# EAGLE design 808_CB (EAGLE 7.1.0)
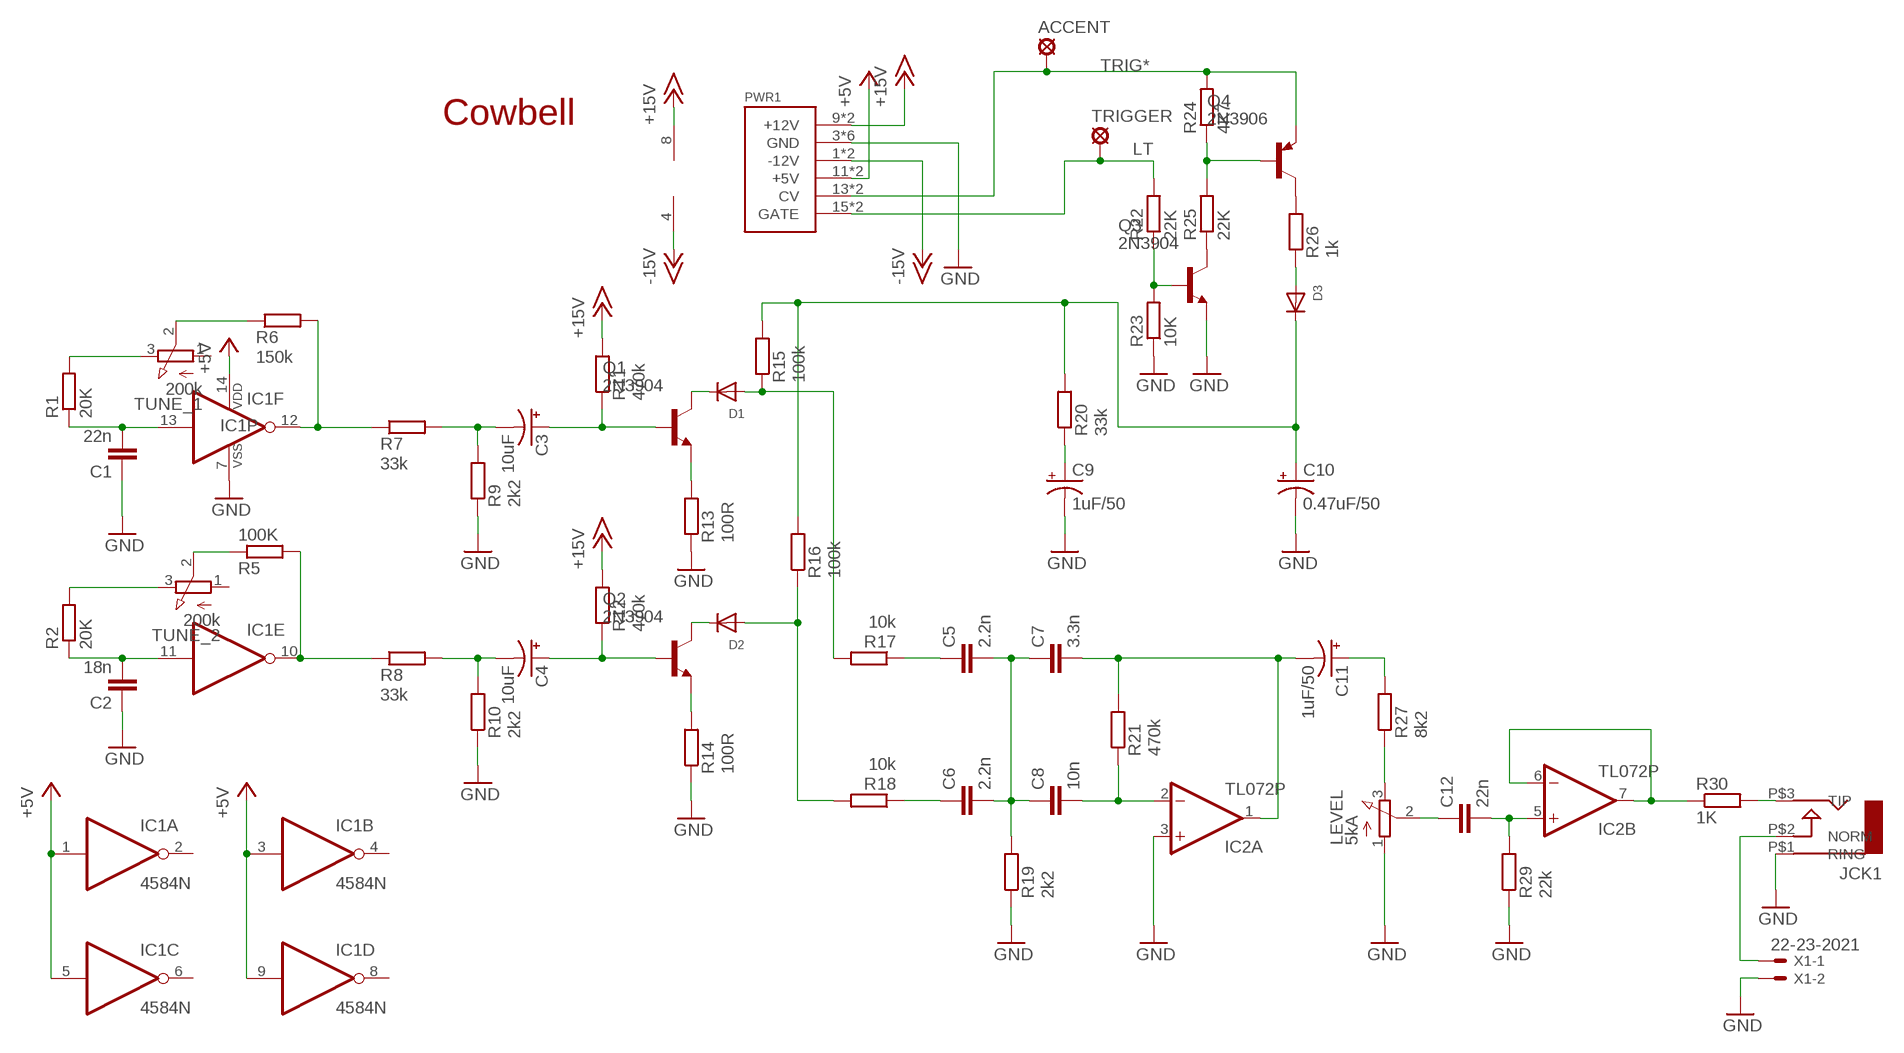
[diagram p0: schematic, sheet 1]

## Parts
ACCENT  LSP11  [LSP11]
C1  22n  C-EU4MM_PITCH  [C035-030X60]
C2  18n  C-EU4MM_PITCH  [C035-030X60]
C3  10uF  CPOL-USB45181A  [B45181A]
C4  10uF  CPOL-USB45181A  [B45181A]
C5  2.2n  C-EU3.5MM_PITCH  [C035-025X75]
C6  2.2n  C-EU3.5MM_PITCH  [C035-025X75]
C7  3.3n  C-EU3.5MM_PITCH  [C035-025X75]
C8  10n  C-EU3.5MM_PITCH  [C035-025X75]
C9  1uF/50  CPOL-USB45181A  [B45181A]
C10  0.47uF/50  CPOL-USB45181A  [B45181A]
C11  1uF/50  CPOL-USB45181A  [B45181A]
C12  22n  C-EU3.5MM_PITCH  [C035-025X75]
D1  DIODEDO-1N4148  [DO-1N4148]
D2  DIODEDO-1N4148  [DO-1N4148]
D3  DIODEDO-1N4148  [DO-1N4148]
IC1  4584N  [DIL14]
IC2  TL072P  [DIL08]
JCK1  AUDIO-JACK  [ERTHENVAR-JACK-90DEG]
LEVEL  5kA  3RP/1610N  [3RP/1610N]
PWR1  POWER  [POWER_16]
Q1  2N3904  [TO92]
Q2  2N3904  [TO92]
Q3  2N3904  [TO92]
Q4  2N3906  [TO92]
R1  20K  R-EU_0207/5V  [0207/5V]
R2  20K  R-EU_0207/5V  [0207/5V]
R5  100K  R-EU_0207/5V  [0207/5V]
R6  150k  R-EU_0207/5V  [0207/5V]
R7  33k  R-EU_0207/5V  [0207/5V]
R8  33k  R-EU_0207/7  [0207/7]
R9  2k2  R-EU_0207/5V  [0207/5V]
R10  2k2  R-EU_0207/5V  [0207/5V]
R11  470k  R-EU_0207/5V  [0207/5V]
R12  470k  R-EU_0207/5V  [0207/5V]
R13  100R  R-EU_0207/5V  [0207/5V]
R14  100R  R-EU_0207/5V  [0207/5V]
R15  100k  R-EU_0207/5V  [0207/5V]
R16  100k  R-EU_0207/5V  [0207/5V]
R17  10k  R-EU_0207/5V  [0207/5V]
R18  10k  R-EU_0207/5V  [0207/5V]
R19  2k2  R-EU_0207/5V  [0207/5V]
R20  33k  R-EU_0207/5V  [0207/5V]
R21  470k  R-EU_0207/5V  [0207/5V]
R22  22K  R-EU_0207/5V  [0207/5V]
R23  10K  R-EU_0207/5V  [0207/5V]
R24  4K7  R-EU_0207/5V  [0207/5V]
R25  22K  R-EU_0207/5V  [0207/5V]
R26  1k  R-EU_0207/5V  [0207/5V]
R27  8k2  R-EU_0207/5V  [0207/5V]
R29  22k  R-EU_0207/5V  [0207/5V]
R30  1K  R-EU_0207/5V  [0207/5V]
TRIGGER  LSP11  [LSP11]
TUNE_1  200k  3RP/1610N  [3RP/1610N]
TUNE_2  200k  3RP/1610N  [3RP/1610N]
X1  22-23-2021  [22-23-2021]

## Nets
+5V: IC1.1(A:I) IC1.3(B:I) IC1.5(C:I) IC1.9(D:I) IC1.14(P:VDD) PWR1.11(+5V) PWR1.12(+5V)
+15V: IC2.8(P:V+) PWR1.9(+12V) PWR1.10(+12V) R11.2 R12.2
-15V: IC2.4(P:V-) PWR1.1(-12V) PWR1.2(-12V)
CY_OUT: JCK1.P$3(TIP) R30.2
GND [GND]: C1.P$1 C2.P$1 C9.- C10.- IC1.7(P:VSS) IC2.3(A:+IN) JCK1.P$1(RING) LEVEL.1(A) PWR1.3(GND) PWR1.4(GND) PWR1.5(GND) PWR1.6(GND) PWR1.7(GND) PWR1.8(GND) Q3.3(E) R9.1 R10.1 R13.1 R14.1 R19.1 R23.1 R29.1 X1.2
LT: PWR1.15(GATE) PWR1.16(GATE) R22.2 TRIGGER.MP
N$1: C2.P$2 IC1.11(E:I) R2.1
N$2: C1.P$2 IC1.13(F:I) R1.1
N$3: Q3.1(C) R25.1
N$4: R5.1 TUNE_2.2(S)
N$5: R6.1 TUNE_1.2(S)
N$6: IC1.12(F:O) R6.2 R7.1
N$7: R1.2 TUNE_1.3(E)
N$8: R2.2 TUNE_2.3(E)
N$9: C4.- R8.2 R10.2
N$10: C3.- R7.2 R9.2
N$11: C4.+ Q2.2(B) R12.1
N$12: C3.+ Q1.2(B) R11.1
N$13: Q1.3(E) R13.2
N$14: Q2.3(E) R14.2
N$15: D2.C Q2.1(C)
N$16: D1.C Q1.1(C)
N$17: C10.+ D3.C R15.2 R16.2 R20.2
N$18: Q4.1(C) R26.2
N$19: D3.A R26.1
N$20: C9.+ R20.1
N$21: D2.A R16.1 R18.2
N$22: D1.A R15.1 R17.2
N$23: C5.P$1 R17.1
N$24: C6.P$1 R18.1
N$25: C5.P$2 C6.P$2 C7.P$1 C8.P$1 R19.2
N$26: C8.P$2 IC2.2(A:-IN) R21.1
N$27: C7.P$2 C11.- IC2.1(A:OUT) R21.2
N$28: JCK1.P$2(NORM) X1.1
N$29: LEVEL.3(E) R27.1
N$30: C11.+ R27.2
N$31: C12.P$1 LEVEL.2(S)
N$32: C12.P$2 IC2.5(B:+IN) R29.2
N$33: IC2.6(B:-IN) IC2.7(B:OUT) R30.1
N$516: Q4.2(B) R24.1 R25.2
N$517: Q3.2(B) R22.1 R23.2
TP7: IC1.10(E:O) R5.2 R8.1
TRIG*: ACCENT.MP PWR1.13(CV) PWR1.14(CV) Q4.3(E) R24.2
Unconnected: IC1.2(A:O) IC1.4(B:O) IC1.6(C:O) IC1.8(D:O) TUNE_1.1(A) TUNE_2.1(A)

## Notes on the sheet
- Cowbell

## Library data of the parts
ACCENT TRIGGER = solpad:LSP11: SOLDER PAD drill 1.1 mm
C1 C2 C5-C8 C12 = TR808clone:C-EU: CAPACITOR, European symbol Pitch 3mm
C3 C4 C9-C11 = rcl:CPOL-US: POLARIZED CAPACITOR, American symbol
D1-D3 = 808_lt:DIODE: Diode SMADIODE - SMA Surface Mount Package 20V 1A Schottky Diode Digikey: 641-1014-6-ND DO-1N4148 - Through Hole Small Current Diode SOD-123 20V 1 A (.5mV Vf) Schottky Diode - Digikey: MBRX120TPMSCT-ND SOD-323 10V 570mA (.38mV Vf, 3ns) Schottky Diode - Digikey: ZLLS410CT-ND SOD-523 30V 30mA Schottky Diode (RB751S-40TE61) - Digikey: RB751S-40TE61CT-ND SOT23-R/W - SOT23 Package (R = Solder Paste/Reflow Ovens, W = Hand-Soldering) BAT54Film 40V 300mA - Digikey: 497-7162-1-ND
IC1 = TR808clone:4584: Hex SCHMITT TRIGGER (74C14)
IC2 = linear:TL072: OP AMP
JCK1 = erthenvar:AUDIO-JACK: Switching Mono 3.5mm Audio Jack from Erthenvar.
LEVEL TUNE_1 TUNE_2 = pot:3RP/1610N: 16mm Potentiometer one level Source: http://www.alphapotentiometers.net/html/16mm_pot_2.html
PWR1 = eurorack:POWER
Q1-Q3 = transistor-npn:2N3904: NPN Transistor
Q4 = transistor-pnp:2N3906: PNP Transistor
R1 R2 R5-R27 R29 R30 = TR808clone:R-EU_: RESISTOR, European symbol
X1 = con-molex:22-23-2021: .100" (2.54mm) Center Header - 2 Pin; MF: MOLEX; MPN: 22-23-2021; OC_FARNELL: 1462926; OC_NEWARK: 25C3832

## Net classes
0 default: width 0.635 mm, drill 0.254 mm, clearance 0.254 mm
1 GND: width 1.016 mm, drill 1.016 mm, clearance 0.508 mm

## Board
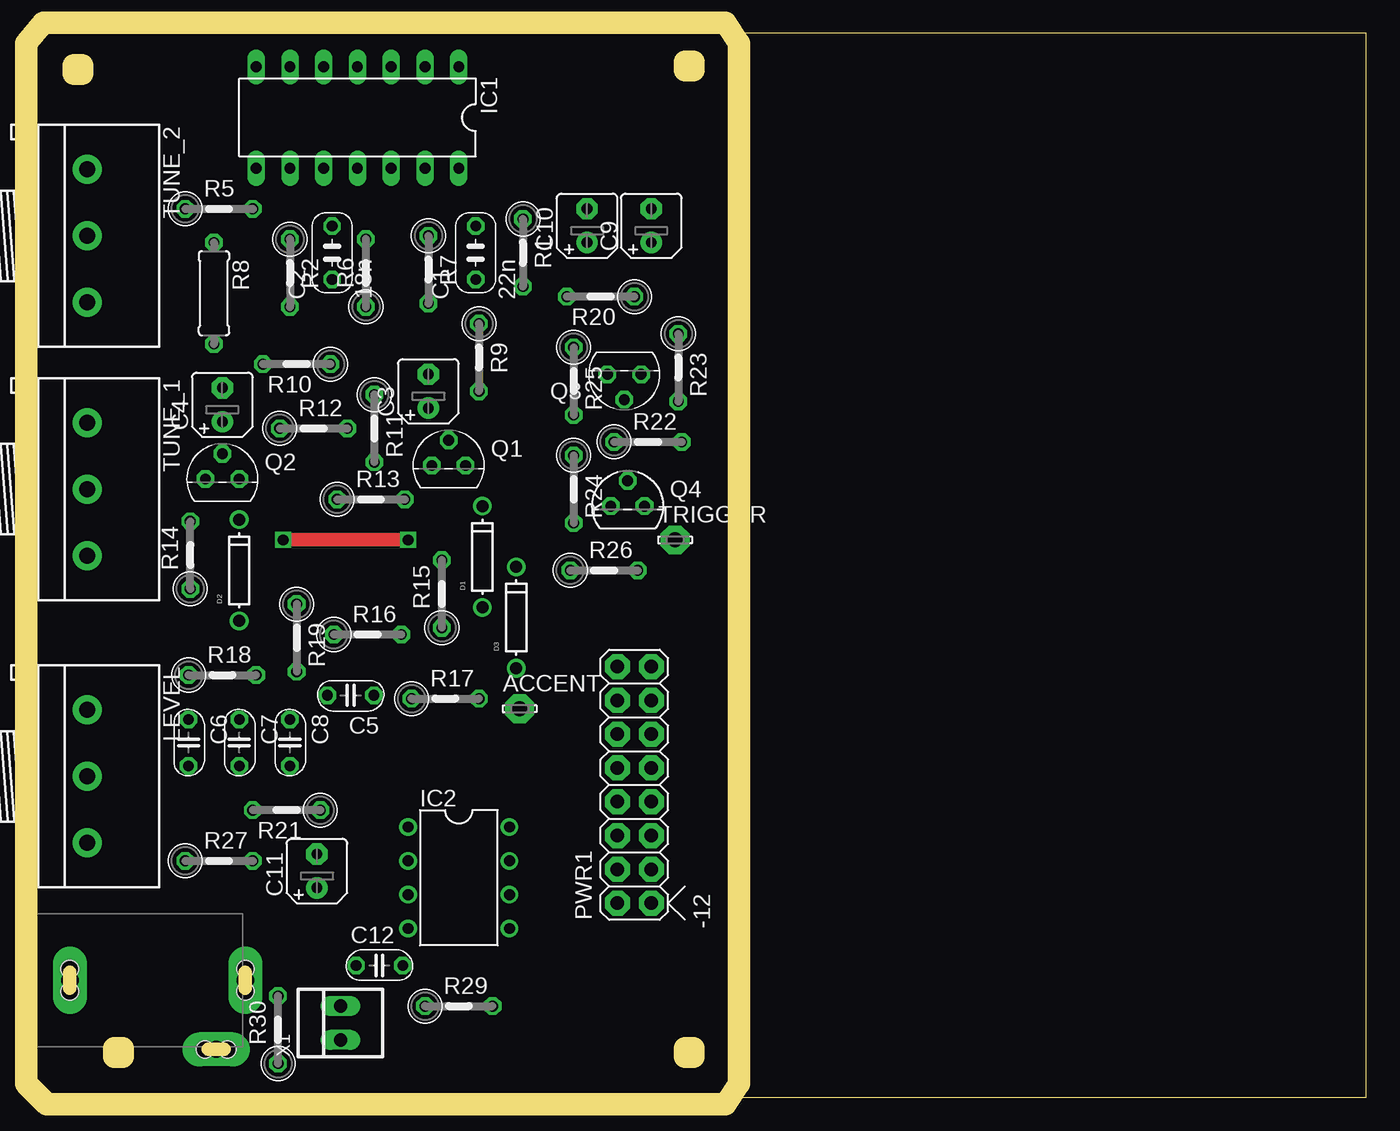
[diagram p1: board, top side]
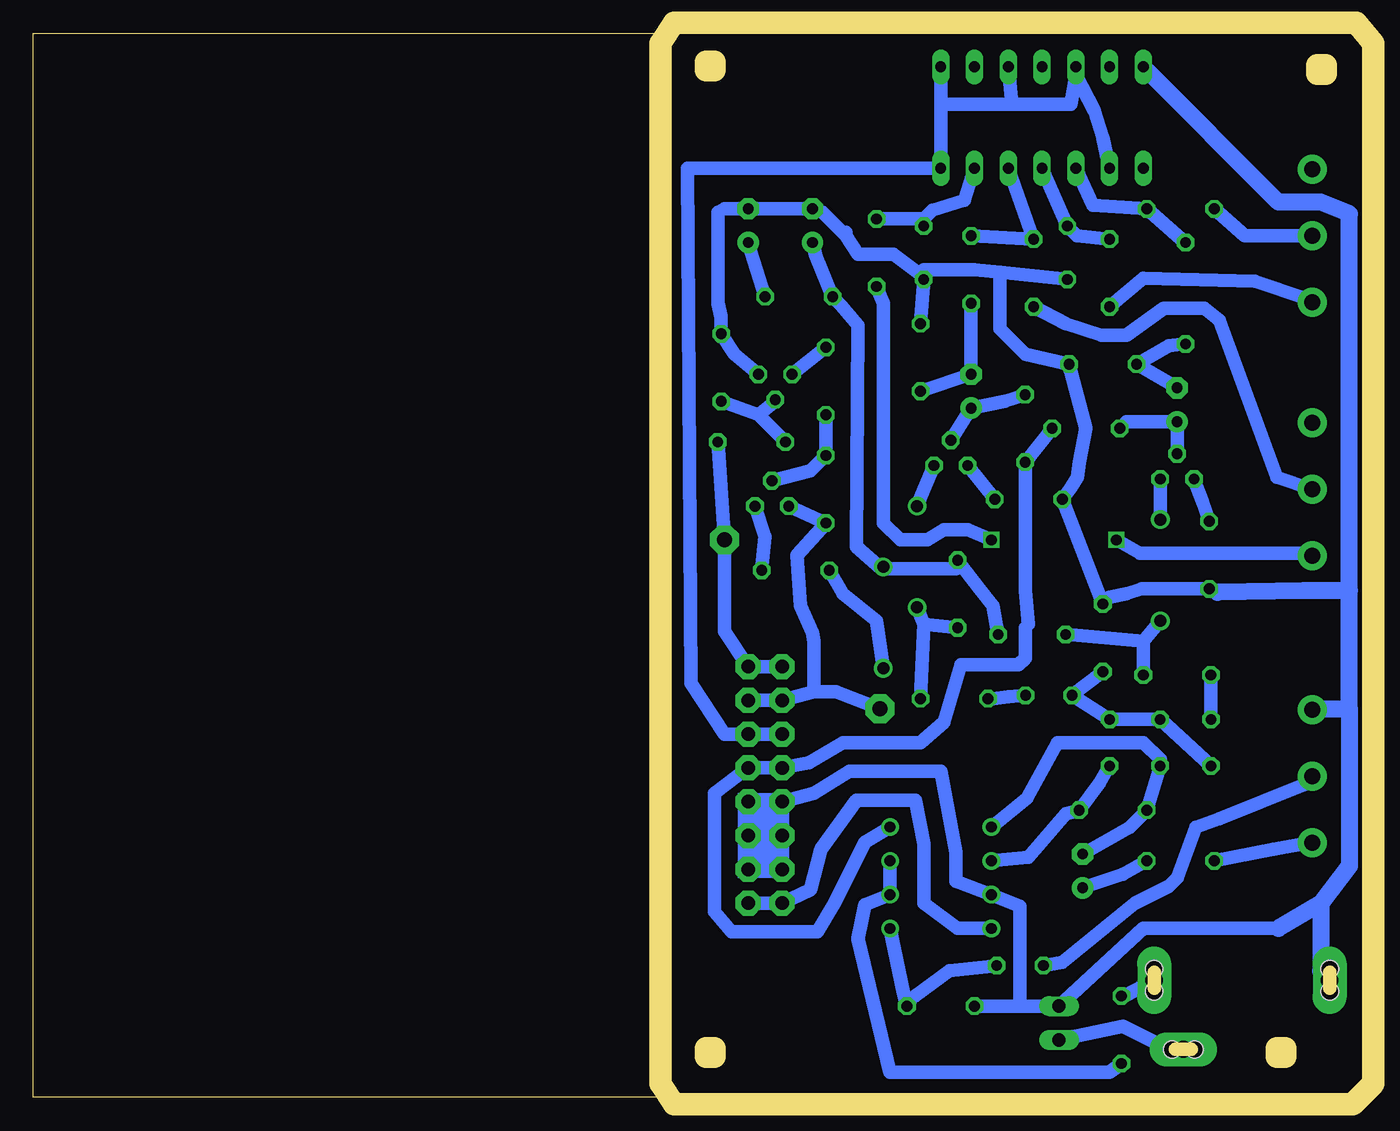
[diagram p2: board, bottom side, seen from below]

Size 100 x 80 mm. Coordinates in mm from the lower left corner, seen from the top.
Outline: 0,0 100,0 100,80 0,80 0,0
Copper layers (1*16): Top 0.035mm / dielectric 1.5mm / Bottom 0.035mm
Design rules "default *": minimum track width 32mil, minimum drill 31mil, track to track 18mil, track to pad 18mil, pad to pad 18mil, via to via 18mil, smd to smd 8mil, copper to edge 0mil, drill to drill 18mil, minimum pad ring 10mil, minimum via ring 8mil, stop-mask expansion 4mil, vias tented up to drill 0mil, thermal gap 10mil
Milling: 24 lines

### Footprints (pad centres in the part's own frame; a part is rotated, then mirrored left to right if it is on the bottom)
LSP11 = drill 1.118 pad 2.159 octagon: MP 0,0
C035-030X60 = drill 0.8 octagon: P$1 -2,0; P$2 2,0
B45181A = drill 0.813 pad 1.6: + -1.27,0 | drill 0.813 pad 1.6 octagon: - 1.27,0
C035-025X75 = drill 0.8 octagon: P$1 -1.75,0; P$2 1.75,0
DO-1N4148 = drill 0.9: A -3.81,0; C 3.81,0
DIL14 = drill 0.813 long: 1 -7.62,-3.81; 2 -5.08,-3.81; 3 -2.54,-3.81; 4 0,-3.81; 5 2.54,-3.81; 6 5.08,-3.81; 7 7.62,-3.81; 8 7.62,3.81; 9 5.08,3.81; 10 2.54,3.81; 11 0,3.81; 12 -2.54,3.81; 13 -5.08,3.81; 14 -7.62,3.81
DIL08 = drill 0.813 pad 1.27: 1 -3.81,-3.81; 2 -1.27,-3.81; 3 1.27,-3.81; 4 3.81,-3.81; 5 3.81,3.81; 6 1.27,3.81; 7 -1.27,3.81; 8 -3.81,3.81
ERTHENVAR-JACK-90DEG = drill 1.3 pad 2.54 long: P$1 5,-2.5; P$2 -0.2,-13.5; P$3 5,-15.7 | hole 1.3: 5.842,-2.489; 4.14,-2.489; -0.203,-12.649; -0.203,-14.351; 5.842,-15.697; 4.166,-15.697
3RP/1610N = drill 1.2 pad 2.184: 1 -5,0; 2 0,0; 3 5,0
POWER_16 = drill 1.016 pad 1.88 octagon: 1 -6.35,-1.27; 2 -6.35,1.27; 3 -3.81,-1.27; 4 -3.81,1.27; 5 -1.27,-1.27; 6 -1.27,1.27; 7 1.27,-1.27; 8 1.27,1.27; 9 3.81,-1.27; 10 3.81,1.27; 11 6.35,-1.27; 12 6.35,1.27; 13 8.89,-1.27; 14 8.89,1.27; 15 11.43,-1.27; 16 11.43,1.27
TO92 = drill 0.813 octagon: 1 1.27,0; 2 0,1.905; 3 -1.27,0
0207/5V = drill 0.813 octagon: 1 -2.54,0; 2 2.54,0
0207/7 = drill 0.813 octagon: 1 -3.81,0; 2 3.81,0
22-23-2021 = drill 1 long: 1 -1.27,0; 2 1.27,0

### Placement (x,y rotation side)
ACCENT  36.32,29.21 0 top
C1  33.02,63.5 90 top
C2  22.23,63.5 90 top
C3  29.46,53.09 90 top
C4  13.97,52.07 90 top
C5  23.62,30.23 180 top
C6  11.43,26.67 270 top
C7  15.24,26.67 270 top
C8  19.05,26.67 270 top
C9  46.23,65.53 90 top
C10  41.4,65.53 90 top
C11  21.08,17.02 90 top
C12  25.78,9.91 0 top
D1  33.53,40.64 90 top
D2  15.24,39.62 90 top
D3  36.07,36.07 90 top
IC1  24.13,73.66 180 top
IC2  31.75,16.51 270 top
JCK1  0,3.81 90 top
LEVEL  3.81,24.13 270 top
PWR1  44.96,20.95 90 top
Q1  30.99,47.5 0 top
Q2  13.97,46.48 0 top
Q3  44.2,54.36 180 top
Q4  44.45,44.45 0 top
R1  36.58,63.5 270 top
R2  19.05,61.98 270 top
R5  13.72,66.8 0 top
R6  24.77,61.98 90 top
R7  29.46,62.23 270 top
R8  13.34,60.45 270 top
R9  33.27,55.63 270 top
R10  19.56,55.12 180 top
R11  25.4,50.29 270 top
R12  20.83,50.29 0 top
R13  25.15,44.96 0 top
R14  11.56,40.77 90 top
R15  30.48,37.85 90 top
R16  24.89,34.8 0 top
R17  30.73,29.97 0 top
R18  13.97,31.75 0 top
R19  19.56,34.54 270 top
R20  42.42,60.2 180 top
R21  18.8,21.59 180 top
R22  45.97,49.28 0 top
R23  48.26,54.86 270 top
R24  40.39,45.72 270 top
R25  40.39,53.85 270 top
R26  42.67,39.62 0 top
R27  13.72,17.78 0 top
R29  31.75,6.86 0 top
R30  18.16,5.08 90 top
TRIGGER  48.01,41.91 0 top
TUNE_1  3.81,45.72 270 top
TUNE_2  3.81,64.77 270 top
X1  22.86,5.59 90 top

### Tracks (layer width: path | path; a pad name or v marks a point on that pad's centre or on a via)
+5V
  Bottom 0.813: 21.59,76.83 IC1.5
  Bottom 1.016: IC1.9 19.56,72.14 20.19,74.17 21.59,76.83 21.97,74.68 26.42,74.68 | PWR1.12 PWR1.11 48.01,27.3 50.55,31.11 50.8,69.85 IC1.14 31.75,74.68 | IC1.1 31.75,74.68 | 26.42,74.68 IC1.3 | 31.75,74.68 26.42,74.68
+15V
  Bottom 1.016: IC2.8 37.47,19.18 39.75,14.61 41.02,12.45 47.5,12.45 48.77,13.97 48.77,22.86 PWR1.9 PWR1.10 41.66,25.15 39.12,26.67 33.27,26.67 31.5,28.19 30.23,32.51 25.91,32.51 25.4,33.02 25.4,35.31 25.15,35.56 25.4,38.1 R11.2 R12.2
-15V
  Bottom 1.016: IC2.4 30.48,12.7 33.02,14.61 33.02,19.05 33.66,22.35 38.1,22.35 40.77,18.67 41.53,15.62 PWR1.2 PWR1.1
CY_OUT
  Bottom 0.813: R30.2 17.91,7.62
  Bottom 1.016: 17.91,7.62 JCK1.P$3
GND
  Bottom 0.813: 3.17,9.48 JCK1.P$1
  Bottom 1.016: PWR1.7 PWR1.8 | PWR1.6 PWR1.4 PWR1.3 | PWR1.6 PWR1.5 | PWR1.6 PWR1.8 | 25.78,6.86 X1.2 16.51,12.7 6.35,12.7 | 25.78,6.86 25.78,14.35 IC2.3 30.61,16.26 30.61,18.41 31.75,24.51 38.61,24.51 41.27,22.86 PWR1.8 | R29.1 25.78,6.86 | Q3.3 47.24,55.88 R23.1 48.26,58.67 48.51,59.69 48.51,66.55 48.01,66.8 C9.- C10.- 40.64,66.55 38.86,64.77 | R9.1 C1.P$1 33.02,61.59 33.34,61.91 | 33.34,61.91 35.31,63.37 37.97,63.37 38.86,64.77 | 27.26,62.03 29.21,62.23 33.02,62.23 33.34,61.91 | 27.26,62.03 C2.P$1 | 3.81,29.21 LEVEL.1 | 10.92,37.97 R14.1 16.64,38.23 17.78,37.85 19.05,37.59 R19.1 R13.1 21.97,45.85 21.46,46.61 21.34,47.75 20.83,50.29 R10.1 25.4,55.88 27.3,57.78 27.3,61.98 27.26,62.03 | 38.86,64.77 38.86,65.02
  Bottom 1.27: IC1.7 6.35,67.31 3.17,67.31 1.02,66.42 1.02,38.1 | 1.02,29.21 1.02,38.1 | 3.81,29.21 1.02,29.21 | 10.92,37.97 4.45,38.1 1.02,38.1 | 3.17,14.61 1.02,17.4 1.02,29.21 | 3.17,14.61 6.35,12.7 | 3.17,14.61 3.17,9.48
LT
  Bottom 1.016: PWR1.16 PWR1.15 48.01,35.05 TRIGGER.MP R22.2
N$1
  Bottom 1.016: IC1.11 C2.P$2 21.5,64.77 R2.1
N$2
  Bottom 1.016: R1.1 33.02,66.04 | IC1.13 29.97,67.44 32.38,66.67 33.02,66.04 | 33.02,66.04 C1.P$2
N$3
  Bottom 1.016: R25.1 Q3.1
N$4
  Bottom 1.016: TUNE_2.2 8.89,64.77 R5.1
N$5
  Bottom 1.016: R6.1 22.35,58.17 19.68,57.28 17.78,57.28 14.99,59.31 11.94,59.31 10.79,58.42 6.48,46.61 TUNE_1.2
N$6
  Bottom 1.016: IC1.12 R6.2 R7.1
N$7  (via drill 0.8)
  Top 1.016: v27.94,41.91 v18.54,41.91
  Bottom 1.016: R1.2 36.07,59.69 36.07,43.18 34.8,41.91 32.77,41.91 31.5,42.67 29.72,42.67 v27.94,41.91 | v18.54,41.91 16.76,40.89 3.98,40.89 TUNE_1.3
N$8
  Bottom 0.813: 4.32,60.07 TUNE_2.3
  Bottom 1.016: R2.2 16.51,61.59 8.13,61.34 4.32,60.07
N$9
  Bottom 1.016: C4.- R10.2 14.61,56.52 R8.2
N$10
  Bottom 1.016: R9.2 C3.- R7.2
N$11
  Bottom 0.813: 17.78,50.8 R12.1
  Bottom 1.016: Q2.2 C4.+ 17.78,50.8
N$12
  Bottom 1.016: Q1.2 C3.+ 26.92,52.32 R11.1
N$13
  Bottom 1.016: Q1.3 R13.2
N$14
  Bottom 1.016: R14.2 12.06,44.83 Q2.3
N$15
  Bottom 1.016: D2.C Q2.1
N$16
  Bottom 1.016: Q1.1 33.02,45.72 D1.C
N$17
  Bottom 0.813: R15.2 30.61,39.75
  Bottom 1.016: R16.2 27.81,36.96 28.83,38.23 R15.2 | 30.61,39.75 36.2,39.75 | 36.2,39.75 38.1,41.4 37.97,58.04 39.24,59.56 R20.2 41.15,63.25 C10.+ | 36.2,39.75 D3.C
N$18
  Bottom 1.016: Q4.1 44.96,42.16 R26.2
N$19
  Bottom 1.016: R26.1 39.12,37.85 36.58,35.81 D3.A
N$20
  Bottom 1.016: R20.1 C9.+
N$21
  Bottom 1.016: 16.51,34.29 D2.A | R18.2 16.51,34.29 | 16.51,34.29 R16.1
N$22
  Bottom 1.016: D1.A 33.02,35.56 | 33.02,35.56 R17.2 | 33.02,35.56 R15.1
N$23
  Bottom 1.016: R17.1 27.81,29.97 26.67,30.1 C5.P$1
N$24
  Bottom 1.016: R18.1 C6.P$1
N$25
  Bottom 1.016: C6.P$2 C7.P$1 C8.P$1 C5.P$2 R19.2
N$26
  Bottom 1.016: C8.P$2 19.81,23.62 R21.1 22.35,21.34 25.15,18.03 IC2.2
N$27
  Bottom 0.813: 15.24,25.4 C7.P$2
  Bottom 1.016: C7.P$2 R21.2 17.53,20.32 C11.- | IC2.1 25.27,22.48 22.99,26.67 16.51,26.67 15.24,25.4
N$28
  Bottom 0.813: 13.7,3.81 JCK1.P$2
  Bottom 1.016: X1.1 18.03,5.33 14.99,3.81 13.7,3.81
N$29
  Bottom 0.813: 3.81,19.18 LEVEL.3
  Bottom 1.016: R27.1 6.73,18.67 3.81,19.18
N$30
  Bottom 1.016: C11.+ 18.03,16.76 R27.2
N$31
  Bottom 0.813: 4.45,23.5 LEVEL.2
  Bottom 1.016: C12.P$1 22.61,10.16 17.14,14.61 14.61,15.88 13.97,16.51 12.57,20.32 10.79,20.95 4.45,23.5
N$32
  Bottom 0.813: R29.2 33.66,7.62
  Bottom 1.016: 33.66,7.62 31.11,9.53 C12.P$2 | IC2.5 34.54,7.87 R29.2
N$33
  Bottom 1.016: R30.1 19.05,1.91 35.56,1.91 37.97,11.94 37.47,14.48 IC2.6 IC2.7
N$516
  Bottom 1.016: Q4.2 41.53,47.12 R24.1 R25.2
N$517
  Bottom 1.016: Q3.2 44.2,52.32 45.47,51.31 | 45.47,51.31 R23.2 | 45.47,51.31 R22.1
TP7
  Bottom 1.016: R8.1 R5.2 20.32,67.06 IC1.10
TRIG*
  Bottom 1.016: Q4.3 R24.2 42.55,40.77 42.29,36.96 41.4,34.92 41.27,34.29 41.27,30.48 | PWR1.13 PWR1.14 41.27,30.48 | 41.27,30.48 39.62,30.48 ACCENT.MP
(copper drawn outside any net)
  shapes: Bottom area x1